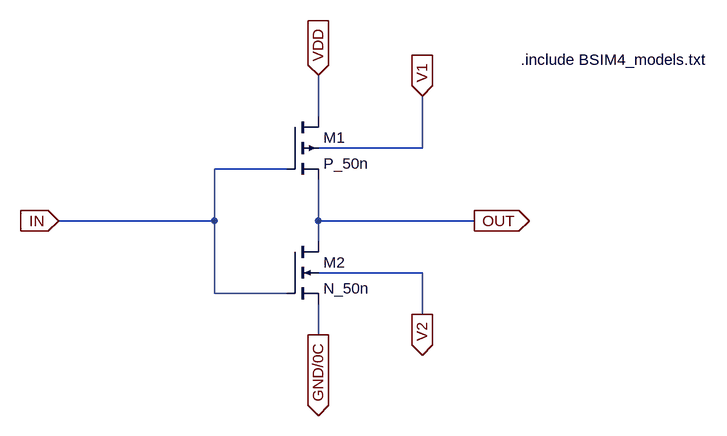
[diagram p0: schematic CMOS_Inv2.asc]
CMOS_Inv2.asc, the LTspice schematic file:
Version 4
SHEET 1 880 680
WIRE 240 48 240 -16
WIRE 400 96 400 16
WIRE 400 96 240 96
WIRE 192 128 80 128
WIRE 80 208 80 128
WIRE 80 208 -160 208
WIRE 240 208 240 144
WIRE 480 208 240 208
WIRE 240 240 240 208
WIRE 400 288 240 288
WIRE 80 320 80 208
WIRE 192 320 80 320
WIRE 400 352 400 288
WIRE 240 384 240 336
FLAG 240 -16 VDD
IOPIN 240 -16 In
FLAG -160 208 IN
IOPIN -160 208 In
FLAG 480 208 OUT
IOPIN 480 208 Out
FLAG 240 384 GND/0C
IOPIN 240 384 Out
FLAG 400 16 V1
IOPIN 400 16 In
FLAG 400 352 V2
IOPIN 400 352 Out
SYMBOL pmos4 192 48 R0
SYMATTR InstName M1
SYMATTR Value P_50n
SYMATTR Value2 l=50n w=1u
SYMBOL nmos4 192 240 R0
SYMATTR InstName M2
SYMATTR Value N_50n
SYMATTR Value2 l=50n w=500n
TEXT 552 -40 Left 2 !.include BSIM4_models.txt

The netlist it stands for:
* CMOS_Inv2.asc
M1 VDD IN OUT V1 P_50n l=50n w=1u
M2 OUT IN GND/0C V2 N_50n l=50n w=500n
.model NMOS NMOS
.model PMOS PMOS
.lib standard.mos
.include BSIM4_models.txt
.backanno
.end